# EAGLE design multiplexor (EAGLE 6.4)
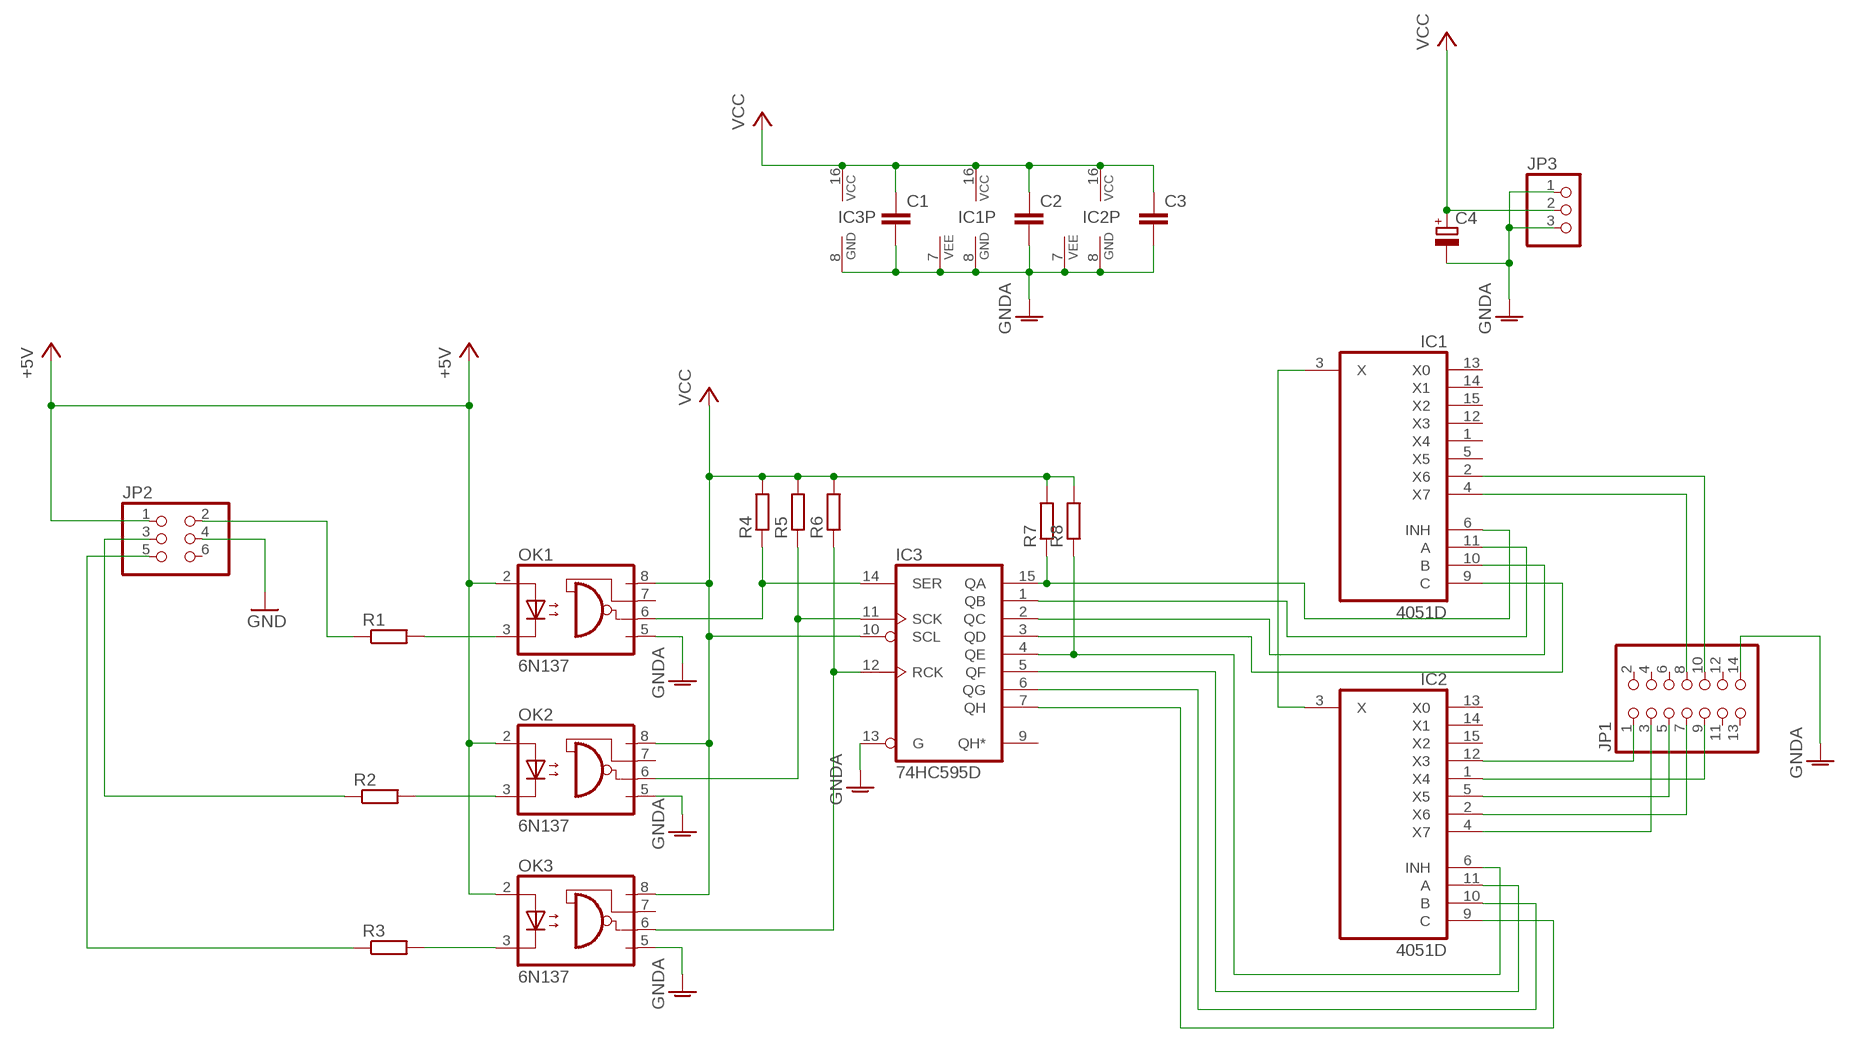
[diagram p0: schematic, sheet 1]

## Parts
C1  C-EUC1206K  [C1206K]
C2  C-EUC1206K  [C1206K]
C3  C-EUC1206K  [C1206K]
C4  CPOL-EUE2.5-6  [E2,5-6]
IC1  4051D  [SO16]
IC2  4051D  [SO16]
IC3  74HC595D  [SO16]
JP1  PINHD-2X7  [2X07]
JP2  PINHD-2X3  [2X03]
JP3  PINHD-1X3  [1X03]
OK1  6N137  [DIL08]
OK2  6N137  [DIL08]
OK3  6N137  [DIL08]
R1  R-EU_R1206  [R1206]
R2  R-EU_R1206  [R1206]
R3  R-EU_R1206  [R1206]
R4  R-EU_R1206  [R1206]
R5  R-EU_R1206  [R1206]
R6  R-EU_R1206  [R1206]
R7  R-EU_R1206  [R1206]
R8  R-EU_R1206  [R1206]

## Nets
+5V: JP2.1 OK1.2(A) OK2.2(A) OK3.2(A)
GND: JP2.4
GNDA: C1.2 C2.2 C3.2 C4.- IC1.7(VEE) IC1.8(GND) IC2.7(VEE) IC2.8(GND) IC3.8(GND) IC3.13(G) JP1.14 JP3.1 JP3.3 OK1.5(GND) OK2.5(GND) OK3.5(GND)
N$1: IC1.6(INH) IC3.15(QA) R7.1
N$2: IC1.11(A) IC3.1(QB)
N$3: IC1.10(B) IC3.2(QC)
N$4: IC1.9(C) IC3.3(QD)
N$5: IC2.6(INH) IC3.4(QE) R8.1
N$6: IC2.11(A) IC3.5(QF)
N$7: IC2.10(B) IC3.6(QG)
N$8: IC2.9(C) IC3.7(QH)
N$9: IC1.3(X) IC2.3(X)
N$10: IC1.2(X6) JP1.10
N$11: IC2.12(X3) JP1.1
N$12: IC1.4(X7) JP1.8
N$13: IC2.4(X7) JP1.3
N$14: IC2.5(X5) JP1.5
N$15: IC2.2(X6) JP1.7
N$16: IC2.1(X4) JP1.9
N$17: OK1.3(C) R1.2
N$18: OK2.3(C) R2.2
N$19: OK3.3(C) R3.2
N$20: IC3.14(SER) OK1.6(VO) R4.1
N$21: IC3.11(SCK) OK2.6(VO) R5.1
N$22: IC3.12(RCK) OK3.6(VO) R6.1
N$23: JP2.2 R1.1
N$24: JP2.3 R2.1
N$25: JP2.5 R3.1
VCC: C1.1 C2.1 C3.1 C4.+ IC1.16(VCC) IC2.16(VCC) IC3.10(SCL) IC3.16(VCC) JP3.2 OK1.8(VCC) OK2.8(VCC) OK3.8(VCC) R4.2 R5.2 R6.2 R7.2 R8.2
Unconnected: IC1.1(X4) IC1.5(X5) IC1.12(X3) IC1.13(X0) IC1.14(X1) IC1.15(X2) IC2.13(X0) IC2.14(X1) IC2.15(X2) IC3.9(QH*) JP1.2 JP1.4 JP1.6 JP1.11 JP1.12 JP1.13 JP2.6 OK1.7(VE) OK2.7(VE) OK3.7(VE)

## Library data of the parts
C1-C3 = rcl:C-EU: CAPACITOR, European symbol
C4 = rcl:CPOL-EU: POLARIZED CAPACITOR, European symbol
IC1 IC2 = 40xx:4051: 8-channel ANALOG MULTIPLEXER
IC3 = 74xx-eu:74*595: 8-bit SHIFT REGISTER, output latch
JP1 = pinhead:PINHD-2X7: PIN HEADER
JP2 = pinhead:PINHD-2X3: PIN HEADER
JP3 = pinhead:PINHD-1X3: PIN HEADER
OK1-OK3 = optocoupler:6N137: MOTOROLA OPTO COUPLER; MPN: 6N137; OC_FARNELL: 1328376; OC_NEWARK: 52M1895
R1-R8 = resistor:R-EU_: RESISTOR, European symbol

## Net classes
0 default: width 0.3 mm, clearance 0 mm

## Board
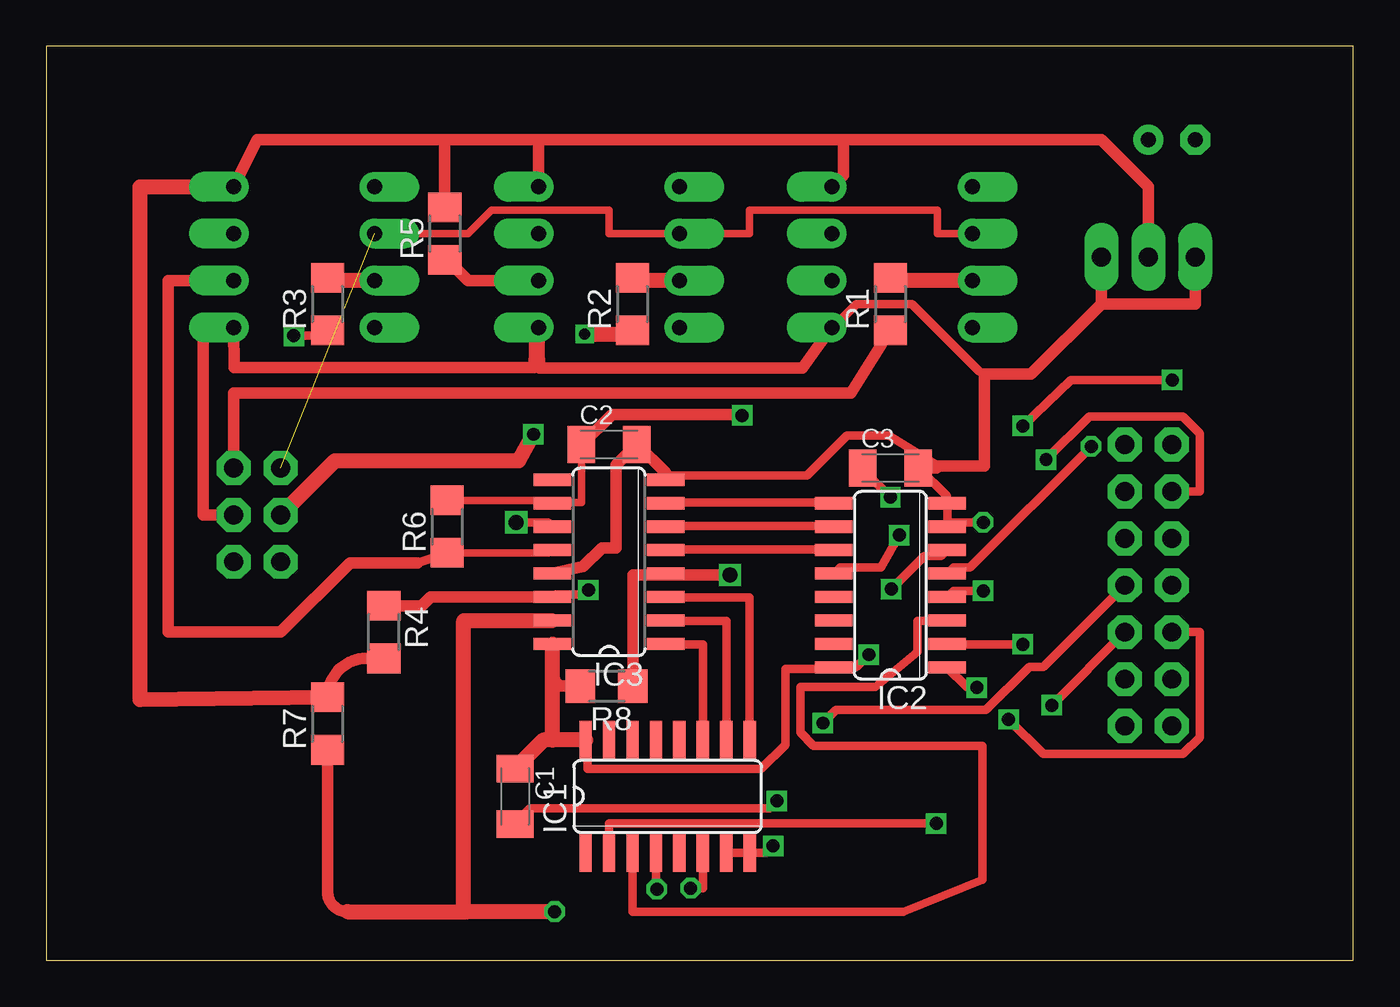
[diagram p1: board, top side]
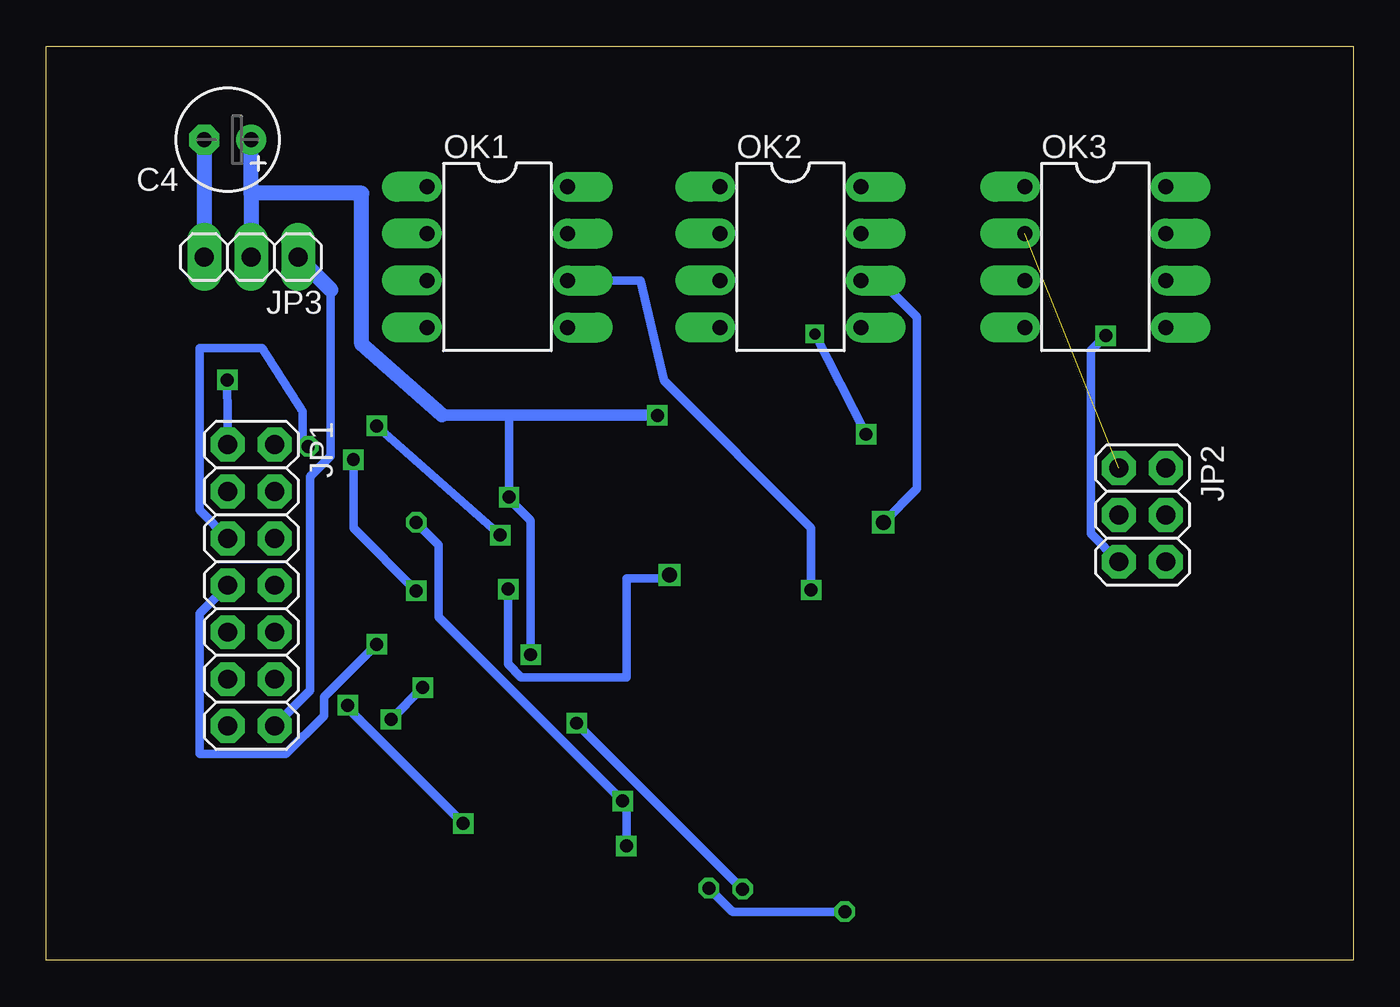
[diagram p2: board, bottom side, seen from below]

Size 70.79 x 49.52 mm. Coordinates in mm from the lower left corner, seen from the top.
Outline: 0,0 70.79,0 70.79,49.52 0,49.52 0,0
Copper layers (1*16): Top 0.035mm / dielectric 1.5mm / Bottom 0.035mm
Design rules "default *": minimum track width 18mil, minimum drill 32mil, track to track 14mil, track to pad 14mil, pad to pad 12mil, via to via 12mil, smd to smd 8mil, copper to edge 40mil, drill to drill 40mil, minimum pad ring 16mil, minimum via ring 8mil, stop-mask expansion 4mil, vias tented up to drill 0mil, thermal gap 14mil

### Footprints (pad centres in the part's own frame; a part is rotated, then mirrored left to right if it is on the bottom)
C1206K = smd 1.5 x 2: 1 -1.5,0; 2 1.5,0
E2,5-6 = drill 0.813 pad 1.6: + -1.27,0 | drill 0.813 pad 1.6 octagon: - 1.27,0
SO16 = smd 0.66 x 2.032: 1 -4.445,-3.073; 2 -3.175,-3.073; 3 -1.905,-3.073; 4 -0.635,-3.073; 5 0.635,-3.073; 6 1.905,-3.073; 7 3.175,-3.073; 8 4.445,-3.073; 9 4.445,3.073; 10 3.175,3.073; 11 1.905,3.073; 12 0.635,3.073; 13 -0.635,3.073; 14 -1.905,3.073; 15 -3.175,3.073; 16 -4.445,3.073
2X07 = drill 1.016 octagon: 1 -7.62,-1.27; 2 -7.62,1.27; 3 -5.08,-1.27; 4 -5.08,1.27; 5 -2.54,-1.27; 6 -2.54,1.27; 7 0,-1.27; 8 0,1.27; 9 2.54,-1.27; 10 2.54,1.27; 11 5.08,-1.27; 12 5.08,1.27; 13 7.62,-1.27; 14 7.62,1.27
2X03 = drill 1.016 octagon: 1 -2.54,-1.27; 2 -2.54,1.27; 3 0,-1.27; 4 0,1.27; 5 2.54,-1.27; 6 2.54,1.27
1X03 = drill 1.016 long: 1 -2.54,0; 2 0,0; 3 2.54,0
DIL08 = drill 0.813 offset: 1 -3.81,-3.81; 2 -1.27,-3.81; 3 1.27,-3.81; 4 3.81,-3.81; 5 3.81,3.81; 6 1.27,3.81; 7 -1.27,3.81; 8 -3.81,3.81
R1206 = smd 1.6 x 1.803: 1 -1.422,0; 2 1.422,0

### Placement (x,y rotation side)
C1  25.4,8.89 270 top
C2  30.48,27.94 0 top
C3  45.72,26.67 0 top
C4  60.96,44.45 180 bottom
IC1  33.66,8.89 0 top
IC2  45.72,20.32 90 top
IC3  30.48,21.59 90 top
JP1  59.69,20.32 270 bottom
JP2  11.43,24.13 270 bottom
JP3  59.69,38.1 180 bottom
OK1  46.35,38.1 270 bottom
OK2  30.48,38.1 270 bottom
OK3  13.97,38.1 270 bottom
R1  45.72,35.56 90 top
R2  31.75,35.56 90 top
R3  15.24,35.56 90 top
R4  18.29,17.78 270 top
R5  21.59,39.37 90 top
R6  21.72,23.5 90 top
R7  15.24,12.83 90 top
R8  30.35,14.86 180 top

### Tracks (layer width: path | path; a pad name or v marks a point on that pad's centre or on a via)
+5V  (1 unrouted)
  Top 0.406: OK3.2 22.86,39.37 24.13,40.64 30.48,40.64 30.48,39.37 OK2.2 38.1,39.37 38.1,40.64 48.26,40.64 48.26,39.37 OK1.2
GND
  Top 0.61: JP2.4 8.51,24.13 8.51,34.29
GNDA  (via drill 0.7)
  Top 0.457: v39.57,8.64 39.17,8.23 26.21,8.23 25.4,7.42 C1.2 | v39.37,6.2 39.01,5.84 38.1,5.84 IC1.8 37.9,5.84 36.83,5.84 IC1.7 | 33.53,26.42 33.53,26.06 IC3.8 | 32,27.94 C2.2 | C3.2 47.24,26.67 48.77,25.15 48.77,24.79 IC2.8 48.82,24.59 48.82,23.52 IC2.7 49.02,23.72 v50.75,23.72 | 48.31,26.77 45.64,28.42 43.36,28.42 41.2,26.26 33.73,26.26 IC3.8 | 33.33,25.96 IC3.8 | 42.52,34.29 OK1.5 42.77,34.44 43.89,35.56 46.89,35.56 50.55,31.9 50.8,31.75 | OK2.5 26.47,34.19
  Top 0.61: OK2.5 26.72,32.08 40.95,32.08 42.52,34.29 | OK3.5 10.19,32.11 26.42,32.11 26.47,34.19 | 33.53,26.42 32,27.94 | 57.15,35.56 53.34,31.75 50.8,31.75 50.8,26.77 48.31,26.77 48.21,26.67 C3.2 | JP3.1 57.15,35.56 | 57.15,35.56 62.23,35.56 JP3.3 | IC3.13 29.08,21.34 30.1,22.35 30.86,22.35 30.86,26.82 C2.2
  Bottom 0.457: JP1.14 56.49,14.63 56.49,26.21 55.37,27.33 55.37,36.32 | v39.37,6.2 39.37,8.43 v39.57,8.64 49.53,18.59 49.53,22.5 v50.75,23.72
  Bottom 0.813: JP3.1 55.37,36.32 | C4.- JP3.3
N$1  (via drill 0.7)
  Top 0.457: 27.38,18.39 IC3.15 | IC1.6 35.56,3.91 v34.9,3.91
  Top 0.61: 22.86,2.64 22.61,2.64 | 16.31,2.64 arc-90 15.24,3.71 R7.1
  Top 0.813: 27.38,18.39 22.61,18.39 22.61,2.64 | v27.53,2.64 22.86,2.64 16.31,2.64
  Bottom 0.457: v34.9,3.91 33.63,2.64 v27.53,2.64
N$2
  Top 0.457: IC1.11 35.56,17.12 33.58,17.12 IC3.1
N$3
  Top 0.457: IC1.10 36.83,18.39 33.58,18.39 IC3.2
N$4
  Top 0.457: IC1.9 38.1,19.66 33.58,19.66 IC3.3
N$5  (via drill 0.7, 0.8)
  Top 0.457: IC2.6 48.46,21.89 47.55,21.89 v45.77,20.12
  Top 0.61: v37.03,20.88 33.55,20.88 | 33.55,20.88 IC3.4 | 33.55,20.88 31.77,20.88 R8.1
  Bottom 0.457: v45.77,20.12 45.77,16.05 45.06,15.34 39.37,15.34 39.37,20.7 37.21,20.7 v37.03,20.88
  Bottom 0.61: v37.03,20.88 37.21,20.88 37.21,20.7
N$6
  Top 0.457: IC3.5 33.58,22.25 42.62,22.25 IC2.11
N$7
  Top 0.457: IC3.6 33.58,23.52 42.62,23.52 IC2.10
N$8
  Top 0.457: IC3.7 33.58,24.79 42.62,24.79 IC2.9
N$9
  Top 0.457: IC1.3 31.75,2.64 46.43,2.64 50.7,4.37 50.7,11.63 41.55,11.63 40.84,12.34 40.84,14.81 44.91,14.81 47.19,16.71 47.19,18.39 48.77,18.39 IC2.3
N$10  (via drill 0.7)
  Top 0.457: IC1.2 30.48,7.42 v48.21,7.42 | JP1.10 v54.46,13.82
  Bottom 0.457: v48.21,7.42 54.46,13.66 v54.46,13.82
N$11  (via drill 0.7)
  Top 0.457: IC2.12 42.98,21.29 45.21,21.29 v46.2,23.04 | v52.88,28.96 55.5,31.45 v60.98,31.45
  Bottom 0.457: v52.88,28.96 v46.2,23.04 | v60.98,31.45 60.96,29.31 JP1.1
N$12  (via drill 0.7)
  Top 0.457: IC1.4 33.02,3.86 v33.07,3.86 | v42.06,12.85 42.77,13.56 50.9,13.56 53.24,15.9 54,15.9 JP1.8
  Bottom 0.457: v42.06,12.85 v33.07,3.86
N$13  (via drill 0.7)
  Top 0.457: IC2.4 49.12,20.02 v50.75,20.02 | v54.15,27.13 56.49,29.46 61.57,29.46 62.48,28.55 62.48,25.4 JP1.3
  Bottom 0.457: v50.75,20.02 54.15,23.42 v54.15,27.13
N$14  (via drill 0.7)
  Top 0.457: IC2.5 49.12,21.29 50.04,21.29 v56.59,27.84
  Bottom 0.457: v56.59,27.84 56.9,28.14 56.9,29.72 59.08,33.17 62.48,33.17 62.48,24.38 JP1.5
N$15  (via drill 0.7)
  Top 0.457: v52.88,17.12 48.82,17.12 IC2.2
  Bottom 0.457: v52.88,17.12 55.73,14.28 55.73,13.26 57.81,11.18 62.48,11.18 62.48,18.8 JP1.7
N$16  (via drill 0.7)
  Top 0.457: IC2.1 49.89,14.78 v50.39,14.78 | v52.12,13.06 54,11.18 61.57,11.18 62.48,12.09 62.48,17.78 JP1.9
  Bottom 0.457: v52.12,13.06 v50.39,14.78
N$17
  Top 0.457: 45.82,36.83 45.72,36.93 R1.2
  Top 0.813: OK1.3 45.82,36.83
N$18
  Top 0.457: 31.85,36.83 31.75,36.93 R2.2
  Top 0.813: OK2.3 31.85,36.83
N$19
  Top 0.457: 15.34,36.83 15.24,36.93 R3.2
  Top 0.813: OK3.3 15.34,36.83
N$20  (via drill 0.7)
  Top 0.457: v29.36,20.07 29.11,19.81 27.58,19.81 IC3.14
  Top 0.61: R4.1 20.34,19.2 20.83,19.68 IC3.14
  Bottom 0.457: OK1.6 38.61,36.83 37.34,31.39 29.36,23.42 v29.36,20.07
N$21  (via drill 0.81)
  Top 0.457: IC3.11 27.18,23.72 v25.45,23.72
  Top 0.61: R5.1 21.74,37.95 22.86,36.83 OK2.6
  Bottom 0.457: v25.45,23.72 23.62,25.55 23.62,34.85 25.6,36.83 OK2.6
N$22
  Top 0.406: 27.38,22.25 27.2,22.07 R6.1
  Top 0.457: 27.38,22.25 IC3.12 | 20.12,21.54 R6.1
  Top 0.61: 20.12,21.54 16.46,21.54 12.7,17.78 6.6,17.78 6.6,36.83 OK3.6
N$23
  Top 0.457: R1.1
  Top 0.61: R1.1 43.59,30.73 10.16,30.73 JP2.2
N$24  (via drill 0.6, 0.7)
  Top 0.457: 31.55,33.93 R2.1 | R2.1
  Top 0.813: v29.16,33.93 31.55,33.93 | v26.39,28.5 25.6,27.08 15.65,27.08 JP2.3
  Bottom 0.457: v26.39,28.5 v29.16,33.93
N$25  (via drill 0.7)
  Top 0.457: R3.1 14.94,33.83 v13.41,33.83 | R3.1
  Bottom 0.457: v13.41,33.83 14.22,33.02 14.22,23.11 JP2.5
VCC  (via drill 0.7)
  Top 0.406: C2.1 28.98,24.79 27.38,24.79 27.25,24.92 R6.2
  Top 0.457: 25.4,10.41 C1.1 | 29.21,11.94 IC1.16 29.31,11.73 29.31,10.36 38.71,10.36 40.03,11.68 40.03,15.8 42.27,15.8 IC2.16 | 27.43,17.12 IC3.16 | 44.25,26.67 C3.1 44.35,26.47 v45.72,25.09 | v37.69,29.52 37.13,29.57 | 29.01,27.94 C2.1 | 42.47,15.9 IC2.16 | 27.38,24.79 IC3.10 | v44.55,16.56 43.89,15.9 42.88,15.9 IC2.16
  Top 0.61: 29.01,27.94 30.63,29.57 37.13,29.57 | OK3.8 11.43,44.45 21.59,44.45 | 21.59,44.45 26.67,44.45 | 26.67,44.45 43.18,44.45 | OK1.8 43.18,42.55 43.18,44.45 | OK2.8 26.67,44.45 | 43.18,44.45 57.15,44.45 59.69,41.91 JP3.2 | R5.2 21.59,44.45 | R8.2 27.81,14.86 27.43,15.24 | R7.2 arc-90 17.35,16.36 R4.2
  Top 0.813: 25.4,10.41 26.92,11.94 27.43,11.94 | 29.21,11.94 27.43,11.94 | 27.43,11.94 27.43,15.24 27.43,17.12 | R7.2 5.08,14.12 5.08,41.91 OK3.8
  Bottom 0.457: 45.72,29.54 v45.72,25.09 45.62,24.89 44.55,23.82 v44.55,16.56
  Bottom 0.61: 49.35,29.54 45.72,29.54 37.69,29.54 v37.69,29.52
  Bottom 0.813: 59.66,41.55 53.7,41.55 53.7,33.38 49.35,29.54 | JP3.2 59.66,38.1 59.66,41.55 | 59.66,41.55 59.69,41.55 C4.+